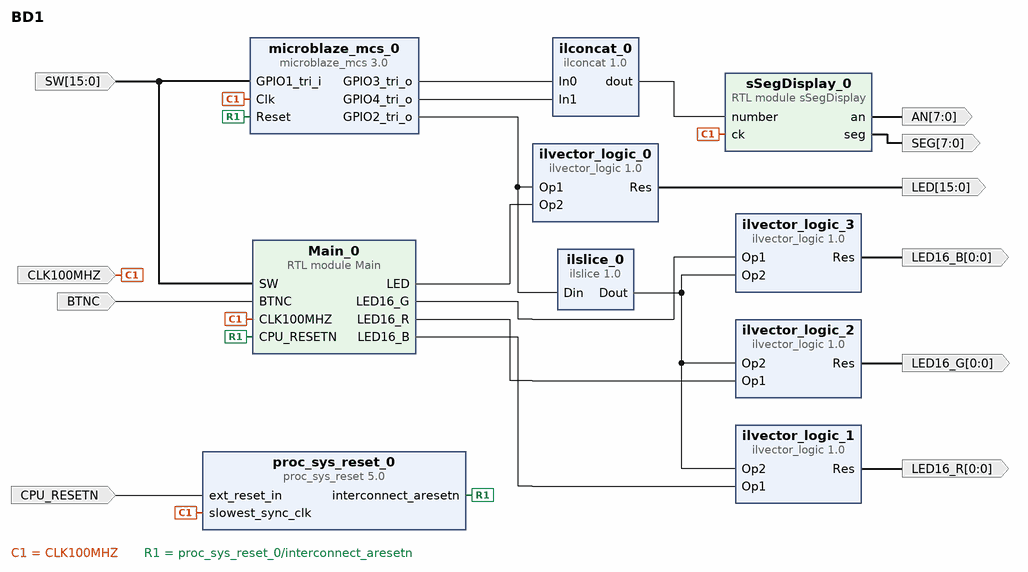
[diagram p0: block diagram of the top level]
# Vivado block design BD1, xc7a50ticsg324-1L, Vivado 2025.1
create_bd_design BD1

create_bd_port -dir I -type clk CLK100MHZ
set_property -dict {CONFIG.FREQ_HZ 100000000 CONFIG.PHASE 0.0} [get_bd_ports CLK100MHZ]
create_bd_port -dir I -type rst CPU_RESETN
set_property -dict {CONFIG.POLARITY ACTIVE_LOW} [get_bd_ports CPU_RESETN]
create_bd_port -dir O -from 0 -to 0 LED16_B
create_bd_port -dir O -from 0 -to 0 LED16_R
create_bd_port -dir O -from 0 -to 0 LED16_G
create_bd_port -dir O -from 15 -to 0 LED
create_bd_port -dir I -from 15 -to 0 SW
create_bd_port -dir O -from 7 -to 0 SEG
create_bd_port -dir O -from 7 -to 0 AN
create_bd_port -dir I BTNC

create_bd_cell -type module -reference Main Main_0
create_bd_cell -type ip -vlnv xilinx.com:ip:microblaze_mcs:3.0 microblaze_mcs_0
set_property -dict [list \
  CONFIG.CLK_BOARD_INTERFACE Custom \
  CONFIG.GPIO1_BOARD_INTERFACE Custom \
  CONFIG.GPIO2_BOARD_INTERFACE Custom \
  CONFIG.GPIO3_BOARD_INTERFACE Custom \
  CONFIG.GPIO4_BOARD_INTERFACE Custom \
  CONFIG.GPO3_SIZE 32 \
  CONFIG.GPO4_SIZE 32 \
  CONFIG.RESET_BOARD_INTERFACE Custom \
  CONFIG.USE_BOARD_FLOW true \
] [get_bd_cells microblaze_mcs_0]
create_bd_cell -type ip -vlnv xilinx.com:ip:proc_sys_reset:5.0 proc_sys_reset_0
set_property -dict {CONFIG.RESET_BOARD_INTERFACE reset CONFIG.USE_BOARD_FLOW true} [get_bd_cells proc_sys_reset_0]
create_bd_cell -type inline_hdl -vlnv xilinx.com:inline_hdl:ilvector_logic:1.0 ilvector_logic_0
set_property -dict {CONFIG.C_SIZE 16} [get_bd_cells ilvector_logic_0]
create_bd_cell -type module -reference sSegDisplay sSegDisplay_0
create_bd_cell -type inline_hdl -vlnv xilinx.com:inline_hdl:ilconcat:1.0 ilconcat_0
create_bd_cell -type inline_hdl -vlnv xilinx.com:inline_hdl:ilvector_logic:1.0 ilvector_logic_1
set_property -dict {CONFIG.C_SIZE 1} [get_bd_cells ilvector_logic_1]
create_bd_cell -type inline_hdl -vlnv xilinx.com:inline_hdl:ilvector_logic:1.0 ilvector_logic_2
set_property -dict {CONFIG.C_SIZE 1} [get_bd_cells ilvector_logic_2]
create_bd_cell -type inline_hdl -vlnv xilinx.com:inline_hdl:ilvector_logic:1.0 ilvector_logic_3
set_property -dict {CONFIG.C_SIZE 1} [get_bd_cells ilvector_logic_3]
create_bd_cell -type inline_hdl -vlnv xilinx.com:inline_hdl:ilslice:1.0 ilslice_0
set_property -dict {CONFIG.DIN_WIDTH 16} [get_bd_cells ilslice_0]

# ---- connections ----

connect_bd_net -net BTNC_0_1 [get_bd_ports BTNC] [get_bd_pins Main_0/BTNC]
connect_bd_net [get_bd_ports CPU_RESETN] [get_bd_pins proc_sys_reset_0/ext_reset_in]
connect_bd_net [get_bd_pins Main_0/LED] [get_bd_pins ilvector_logic_0/Op2]
connect_bd_net [get_bd_pins Main_0/LED16_B] [get_bd_pins ilvector_logic_1/Op1]
connect_bd_net [get_bd_pins Main_0/LED16_G] [get_bd_pins ilvector_logic_3/Op1]
connect_bd_net [get_bd_pins Main_0/LED16_R] [get_bd_pins ilvector_logic_2/Op1]
connect_bd_net [get_bd_ports SW] [get_bd_pins microblaze_mcs_0/GPIO1_tri_i] [get_bd_pins Main_0/SW]
connect_bd_net -net clock_rtl_1 [get_bd_ports CLK100MHZ] \
  [get_bd_pins microblaze_mcs_0/Clk] [get_bd_pins proc_sys_reset_0/slowest_sync_clk] [get_bd_pins sSegDisplay_0/ck] \
  [get_bd_pins Main_0/CLK100MHZ]
connect_bd_net [get_bd_pins ilconcat_0/dout] [get_bd_pins sSegDisplay_0/number]
connect_bd_net [get_bd_pins ilslice_0/Dout] [get_bd_pins ilvector_logic_2/Op2] [get_bd_pins ilvector_logic_1/Op2] [get_bd_pins ilvector_logic_3/Op2]
connect_bd_net [get_bd_pins ilvector_logic_0/Res] [get_bd_ports LED]
connect_bd_net [get_bd_pins ilvector_logic_1/Res] [get_bd_ports LED16_R]
connect_bd_net [get_bd_pins ilvector_logic_2/Res] [get_bd_ports LED16_G]
connect_bd_net [get_bd_pins ilvector_logic_3/Res] [get_bd_ports LED16_B]
connect_bd_net [get_bd_pins microblaze_mcs_0/GPIO2_tri_o] [get_bd_pins ilvector_logic_0/Op1] [get_bd_pins ilslice_0/Din]
connect_bd_net [get_bd_pins microblaze_mcs_0/GPIO3_tri_o] [get_bd_pins ilconcat_0/In0]
connect_bd_net [get_bd_pins microblaze_mcs_0/GPIO4_tri_o] [get_bd_pins ilconcat_0/In1]
connect_bd_net [get_bd_pins proc_sys_reset_0/interconnect_aresetn] [get_bd_pins microblaze_mcs_0/Reset] [get_bd_pins Main_0/CPU_RESETN]
connect_bd_net [get_bd_pins sSegDisplay_0/an] [get_bd_ports AN]
connect_bd_net [get_bd_pins sSegDisplay_0/seg] [get_bd_ports SEG]

validate_bd_design
save_bd_design
